# Altium schematic sheet KF7.62-3P1_KF7.62-3P.schdoc
size 124 x 101 mm
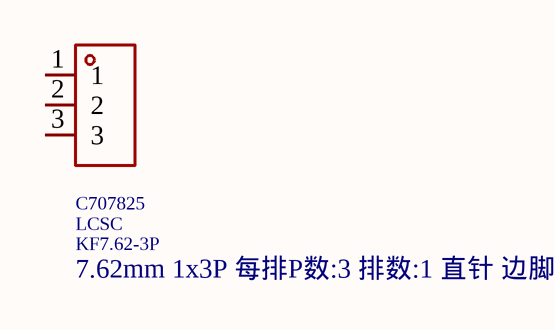
[diagram p0: KF7.62-3P1_KF7.62-3P.schdoc]

## Parts
U?  Supplier: LCSC  Supplier Part: C707825  LCSC Part Name: 7.62mm 1x3P 每排P数:3 排数:1 直针 边脚  [CONN-TH_KF7.62-3P]  (hidden comment: KF7.62-3P)

## Nets

Not connected (* = marked no-connect by the designer): U? 1 2 3

## Library data of the parts
U? = KF7.62-3P: Manufacturer: KEFA(科发); Barrier Type: 2-Side; Pitch: 7.62mm; Add into BOM: yes; Number of Positions or Pins: 1x3P; Pin Location: Side Mount; Number of PINs Per Row: 3; Current Rating: 24A; Voltage Rating (Max): 450V; Wire Gauge - AWG: 12~22; Wire Gauge - mm2: 2.5; Symbol: KF7.62-3P; Device: KF7.62-3P; Manufacturer Part: KF7.62-3P; JLCPCB Part Class: Extended Part; Supplier Footprint: 插件,P=7.62mm; Datasheet: https://item.szlcsc.com/datasheet/KF7.62-3P/745034.html; Convert to PCB: yes; Mounting Type: Straight Pin; Number of Pins: 3P; Number of Rows: 1; Operating Temperature: -40℃~+105℃; Color: Black